# Altium project 100-1069.PRJPCB (part 2 of 2)

## Sheet PAGE115.SchDoc
size 246 x 182 mm
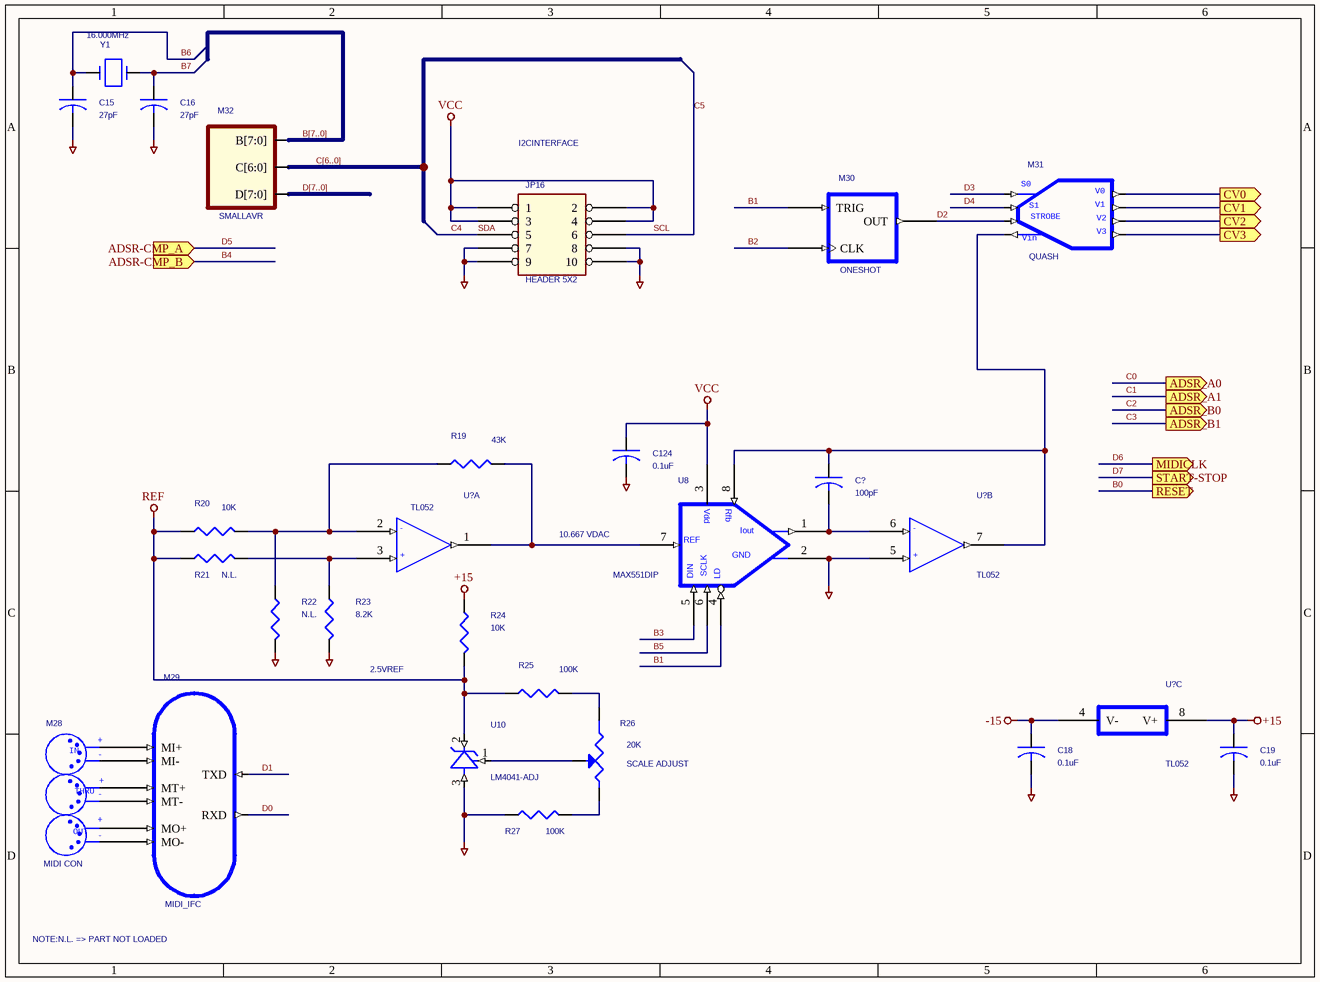
[diagram p13: PAGE115.SchDoc]

### Parts
(Parts that share a designator on the sheet are numbered #1, #2 ... from top to bottom, then left to right.)
C15  27pF  [RAD0.1]
C16  27pF  [RAD0.1]
C18  0.1uF  [AXIALCAP0.3]
C19  0.1uF  [AXIALCAP0.3]
C124  0.1uF  [AXIALCAP0.3]
C?#2  100pF  [RAD0.1]
JP16  HEADER 5X2  [IDC10-AMP]
M28  MIDI CON
M29  MIDI_IFC
M30  ONESHOT
M31  QUASH
M32  SMALLAVR
R19  43K  [AXIAL0.4]
R20  10K  [AXIAL0.4]
R21  N.L.  [AXIAL0.4]
R22  N.L.  [AXIAL0.4]
R23  8.2K  [AXIAL0.4]
R24  10K  [AXIAL0.4]
R25  100K  [AXIAL0.4]
R26  20K  [TRIMPOT-3006]
R27  100K  [AXIAL0.4]
U8  MAX551DIP  [DIP8]
U10  LM4041-ADJ  [TO92-LM336]
U?#1  TL052  [DIP8]  (part A of 3)
U?#2  TL052  [DIP8]  (part B of 3)
U?#3  TL052  [DIP8]  (part C of 3)
Y1  16.000MHz  [XTAL]

### Ports
ADSR-CMP_A (in), ADSR-CMP_B (in), ADSR_A0 (out), ADSR_A1 (out), ADSR_B0 (out), ADSR_B1 (out), CV0 (out), CV1 (out), CV2 (out), CV3 (out), MIDICLK (out), RESET (out), START-STOP (out)

### Nets
+15: C19.1 R24.1 U?#3.8(V+)
-15: C18.1 U?#3.4(V-)
AGND: C15.2 C16.2 C18.2 C19.2 C124.2 JP16.7 JP16.8 JP16.9 JP16.10 R22.2 R23.2 R27.1 U8.2(GND) U10.3(ANODE) U?#2.5(+)  [project net S2]
REF: R20.1 R21.1 R24.2 R25.1 U10.2(CATHODE)
VCC: C124.1 JP16.1 JP16.2 JP16.3 JP16.4 U8.3(VDD)
B1: M30.TRIG U8.4(LD)
B2: M30.CLK
B3: U8.5(DIN)
B5: U8.6(SCLK)
B6: C15.1 Y1.2
B7: C16.1 Y1.1
C4: JP16.5  [also labelled SDA]
C5: JP16.6  [also labelled SCL]
D0: M29.RXD
D1: M29.TXD
D2: M30.OUT M31.STROBE
D3: M31.S0
D4: M31.S1
LFO-F: M31.VO2 ; port CV2
NetC?#2_1: C?#2.1 M31.VIN U8.8(Rfb) U?#2.7(OUT)
NetC?#2_2: C?#2.2 U8.1(Iout) U?#2.6(-)
NetM1#1_IN: M31.VO1 ; port CV1
NetM10_IN: M31.VO0 ; port CV0
NetM28_MI+: M28.MI+ M29.MI+
NetM28_MI-: M28.MI- M29.MI-
NetM28_MO+: M28.MO+ M29.MO+
NetM28_MO-: M28.MO- M29.MO-
NetM28_MT+: M28.MT+ M29.MT+
NetM28_MT-: M28.MT- M29.MT-
NetM31_VO3: M31.VO3 ; port CV3
NetR19_1: R19.1 R20.2 R22.1 U?#1.2(-)
NetR19_2: R19.2 U8.7(VREF) U?#1.1(OUT)
NetR21_2: R21.2 R23.1 U?#1.3(+)
NetR25_2: R25.2 R26.B
NetR26_A: R26.A R27.2
NetR26_WIPER: R26.WIPER U10.1(ADJ)

Not connected (* = marked no-connect by the designer): M32 B[7:0] C[6:0] D[7:0]

### Buses and harness runs
bus B[7..0]
bus C[6..0]
bus D[7..0]

### Notes on the sheet
- I2CINTERFACE
- 10.667 VDAC
- 2.5VREF
- (near R26) SCALE ADJUST
- NOTE:N.L. => PART NOT LOADED
- (in symbol MAX551DIP) Vdd; REF
- (in symbol MIDI CON) +; IN; -; THRU; OUT
- (in symbol QUASH) V0; V1; V2; V3; Vin

### Library data of the parts
C15 C16 C18 C19 C124 C?#2 = CAP_Dup1
R19-R25 R27 = R_Dup1
R26 = POT
U?#1-U?#3 = GEN DUAL OPAMP-H: PACKAGE: MIDI2CV
Y1 = CRYSTAL
M28 = MIDI CON: TitleBlock_1_Page_Number: =M28_TitleBlock_1_Page_Number; TitleBlock_1_Title: =M28_TitleBlock_1_Title
M29 = MIDI_IFC: TitleBlock_4_Page_Number: =M29_TitleBlock_4_Page_Number
M31 = QUASH: C__13_PartReference: =M31_C__13_PartReference; M34_C__21_PartReference: =M31_M34_C__21_PartReference; M34_TitleBlock_1_Page_Number: =M31_M34_TitleBlock_1_Page_Number; M34_TitleBlock_1_Title: =M31_M34_TitleBlock_1_Title; C__14_PartReference: =M31_C__14_PartReference

## Sheet PAGE117.SchDoc
size 246 x 182 mm
Used 2 times, as channels VCO1, VCO2. Parts and nets are listed once, with the designators drawn on the sheet.
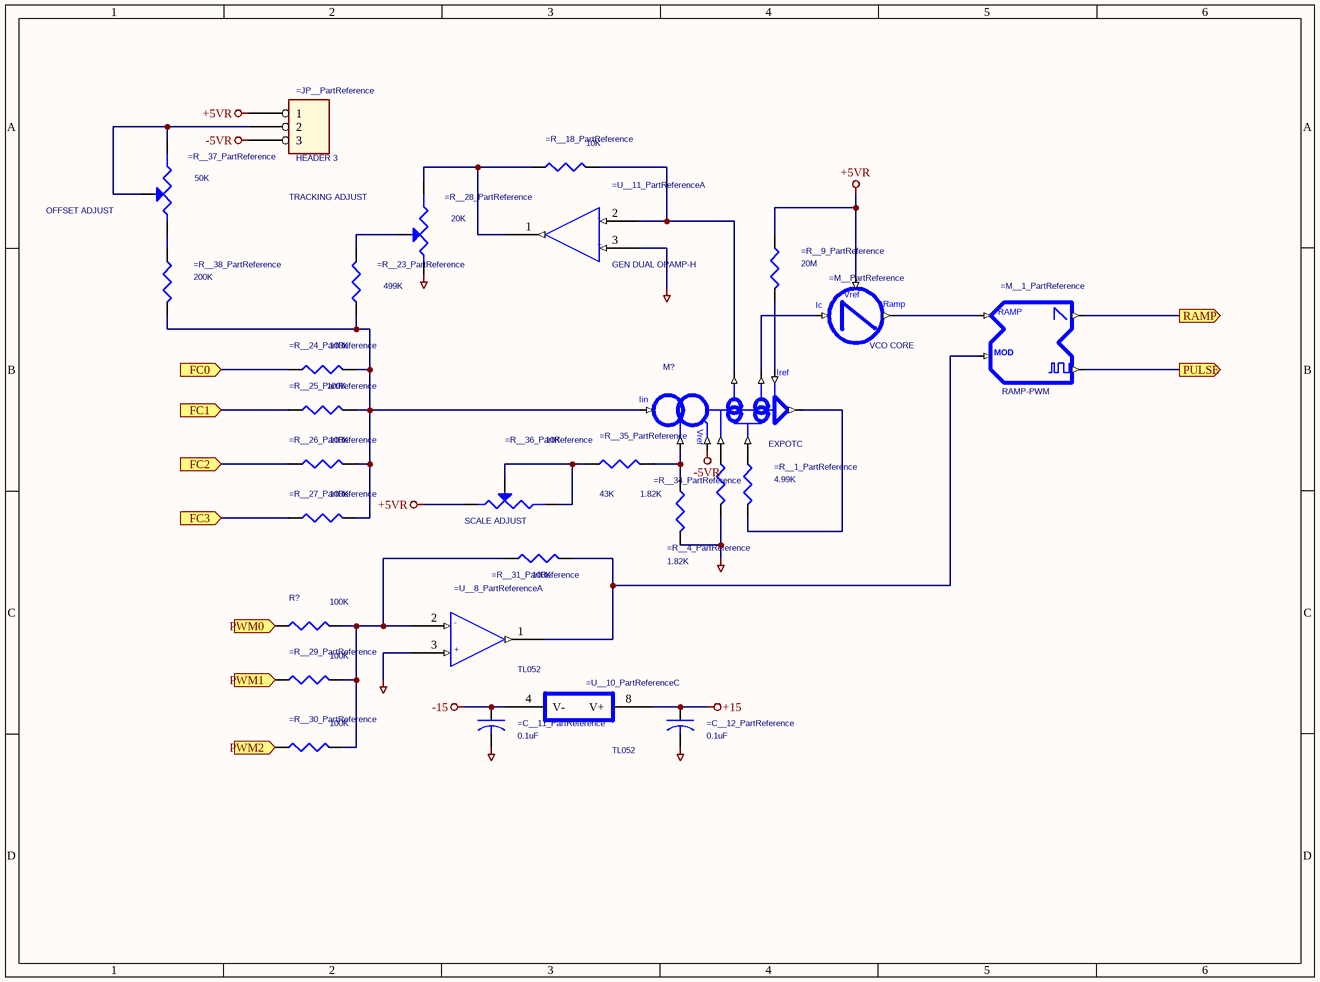
[diagram p14: PAGE117.SchDoc]

### Parts
=C__11_PartReference  0.1uF  [AXIALCAP0.3]
=C__12_PartReference  0.1uF  [AXIALCAP0.3]
=JP__PartReference  HEADER 3  [JP3]
=M__1_PartReference  RAMP-PWM
=M__PartReference  VCO CORE
=R__1_PartReference  4.99K  [AXIAL0.4]
=R__4_PartReference  1.82K  [AXIAL0.4]
=R__9_PartReference  20M  [AXIAL0.4]
=R__18_PartReference  10K  [AXIAL0.4]
=R__23_PartReference  499K  [AXIAL0.4]
=R__24_PartReference  100K  [AXIAL0.4]
=R__25_PartReference  100K  [AXIAL0.4]
=R__26_PartReference  100K  [AXIAL0.4]
=R__27_PartReference  100K  [AXIAL0.4]
=R__28_PartReference  20K  [TRIMPOT-3006]
=R__29_PartReference  100K  [AXIAL0.4]
=R__30_PartReference  100K  [AXIAL0.4]
=R__31_PartReference  100K  [AXIAL0.4]
=R__34_PartReference  1.82K  [AXIAL0.4]
=R__35_PartReference  43K  [AXIAL0.4]
=R__36_PartReference  10K  [TRIMPOT-3006]
=R__37_PartReference  50K  [TRIMPOT-3006]
=R__38_PartReference  200K  [AXIAL0.4]
=U__8_PartReference  TL052  [DIP8]  (part A of 3)
=U__10_PartReference  TL052  [DIP8]  (part C of 3)
=U__11_PartReference  GEN DUAL OPAMP-H  [DIP8]  (part A of 3)
M?  EXPOTC
R?  100K  [AXIAL0.4]

### Ports
FC0 (in), FC1 (in), FC2 (in), FC3 (in), PULSE (out), PWM0 (in), PWM1 (in), PWM2 (in), RAMP (out)

### Nets
+5VR: =JP__PartReference.1 =M__PartReference.VREF5P =R__9_PartReference.1 =R__36_PartReference.A
+15: =C__12_PartReference.1 =U__10_PartReference.8(V+)
-5VR: =JP__PartReference.3 M?.-VREF
-15: =C__11_PartReference.1 =U__10_PartReference.4(V-)
AGND: =C__11_PartReference.2 =C__12_PartReference.2 =R__4_PartReference.2 =R__28_PartReference.A =R__34_PartReference.2 =U__8_PartReference.3(+) =U__11_PartReference.3(+)
FC0: =R__24_PartReference.1 ; port FC0
FC1: =R__25_PartReference.1 ; port FC1
FC2: =R__26_PartReference.1 ; port FC2
FC3: =R__27_PartReference.1 ; port FC3
PULSE: =M__1_PartReference.PWMOUT ; port PULSE
PWM0: R?.1 ; port PWM0
PWM1: =R__29_PartReference.1 ; port PWM1
PWM2: =R__30_PartReference.1 ; port PWM2
RAMP: =M__1_PartReference.RAMPOUT ; port RAMP
Net=JP__PartReference_2: =JP__PartReference.2 =R__37_PartReference.B =R__37_PartReference.WIPER
Net=M__1_PartReference_PWMIN: =M__1_PartReference.PWMIN =R__31_PartReference.2 =U__8_PartReference.1(OUT)
Net=M__1_PartReference_RAMPIN: =M__1_PartReference.RAMPIN =M__PartReference.RAMP
Net=M__PartReference_Ic: =M__PartReference.Ic M?.Io2
Net=R__1_PartReference_1: =R__1_PartReference.1 M?.E
Net=R__1_PartReference_2: =R__1_PartReference.2 M?.O
Net=R__4_PartReference_1: =R__4_PartReference.1 M?.R
Net=R__9_PartReference_2: =R__9_PartReference.2 M?.Iref
Net=R__18_PartReference_1: =R__18_PartReference.1 =R__28_PartReference.B =U__11_PartReference.1(OUT)
Net=R__18_PartReference_2: =R__18_PartReference.2 =U__11_PartReference.2(-) M?.Io1
Net=R__23_PartReference_1: =R__23_PartReference.1 =R__24_PartReference.2 =R__25_PartReference.2 =R__26_PartReference.2 =R__27_PartReference.2 =R__38_PartReference.2 M?.Iin
Net=R__23_PartReference_2: =R__23_PartReference.2 =R__28_PartReference.WIPER
Net=R__29_PartReference_2: =R__29_PartReference.2 =R__30_PartReference.2 =R__31_PartReference.1 =U__8_PartReference.2(-) R?.2
Net=R__34_PartReference_1: =R__34_PartReference.1 =R__35_PartReference.2 M?.GAIN
Net=R__35_PartReference_1: =R__35_PartReference.1 =R__36_PartReference.B =R__36_PartReference.WIPER
Net=R__37_PartReference_A: =R__37_PartReference.A =R__38_PartReference.1

### Channels
VCO1: designators end in _VCO1; ports FC0=Net=R__24_PartReference_VCO1_1 FC1=VP1 FC2=Net=R__26_PartReference_VCO1_1 FC3=Net=R__27_PartReference_VCO1_1 PULSE=Net=M__1_PartReference_VCO1_PWMOUT PWM0=PW1 PWM1=Net=R__29_PartReference_VCO1_1 PWM2=Net=R__30_PartReference_VCO1_1 RAMP=Net=M__1_PartReference_VCO1_RAMPOUT
VCO2: designators end in _VCO2; ports FC0=Net=R__24_PartReference_VCO1_1 FC1=VP2 FC2=Net=R__26_PartReference_VCO1_1 FC3=Net=R__27_PartReference_VCO1_1 PULSE=Net=M__1_PartReference_VCO2_PWMOUT PWM0=PW2 PWM1=Net=R__29_PartReference_VCO1_1 PWM2=Net=R__30_PartReference_VCO1_1 RAMP=Net=M__1_PartReference_VCO2_RAMPOUT

### Notes on the sheet
- OFFSET ADJUST
- TRACKING ADJUST
- (near =R__36_PartReference) SCALE ADJUST
- (in symbol EXPOTC) Vref
- (in symbol RAMP-PWM) RAMP; MOD
- (in symbol VCO CORE_0) Vref; Ramp

### Library data of the parts
=C__11_PartReference =C__12_PartReference = CAP_Dup1
=M__PartReference = VCO CORE_0: U__18_PartReference: =M__U__18_PartReference; C__23_PartReference: =M__C__23_PartReference; Q__12_PartReference: =M__Q__12_PartReference; U__19_PartReference: =M__U__19_PartReference; C__22_PartReference: =M__C__22_PartReference; C__24_PartReference: =M__C__24_PartReference; C__25_PartReference: =M__C__25_PartReference; C__26_PartReference: =M__C__26_PartReference; R__49_PartReference: =M__R__49_PartReference; C__27_PartReference: =M__C__27_PartReference; R__50_PartReference: =M__R__50_PartReference; R__47_PartReference: =M__R__47_PartReference; R__48_PartReference: =M__R__48_PartReference; TitleBlock_6_Page_Number: =M__TitleBlock_6_Page_Number
=R__1_PartReference =R__4_PartReference =R__9_PartReference =R__18_PartReference =R__23_PartReference =R__24_PartReference =R__25_PartReference =R__26_PartReference =R__27_PartReference =R__29_PartReference =R__30_PartReference =R__31_PartReference =R__34_PartReference =R__35_PartReference =R__38_PartReference R? = R_Dup1
=R__28_PartReference =R__36_PartReference =R__37_PartReference = POT
=U__8_PartReference =U__10_PartReference = GEN DUAL OPAMP-H
  =U__8_PartReference: PACKAGE: =U__8_PACKAGE
  =U__10_PartReference: PACKAGE: =U__10_PACKAGE
=M__1_PartReference = RAMP-PWM: M26_PartReference: =M__1_M26_PartReference; M26_PACKAGE: =M__1_M26_PACKAGE; D__PartReference: =M__1_D__PartReference; D__1_PartReference: =M__1_D__1_PartReference; M27_PartReference: =M__1_M27_PartReference; M27_PACKAGE: =M__1_M27_PACKAGE; C__PartReference: =M__1_C__PartReference; U__PartReference: =M__1_U__PartReference; U__PACKAGE: =M__1_U__PACKAGE; C__1_PartReference: =M__1_C__1_PartReference; R__7_PartReference: =M__1_R__7_PartReference; R__10_PartReference: =M__1_R__10_PartReference; R__11_PartReference: =M__1_R__11_PartReference; R__13_PartReference: =M__1_R__13_PartReference; R__20_PartReference: =M__1_R__20_PartReference; R__21_PartReference: =M__1_R__21_PartReference; R__22_PartReference: =M__1_R__22_PartReference; TitleBlock_Page_Number: =M__1_TitleBlock_Page_Number; TitleBlock_Title: =M__1_TitleBlock_Title
=U__11_PartReference = GEN DUAL OPAMP-H: PACKAGE: =U__11_PACKAGE

## Sheet PAGE110.SchDoc
size 246 x 182 mm
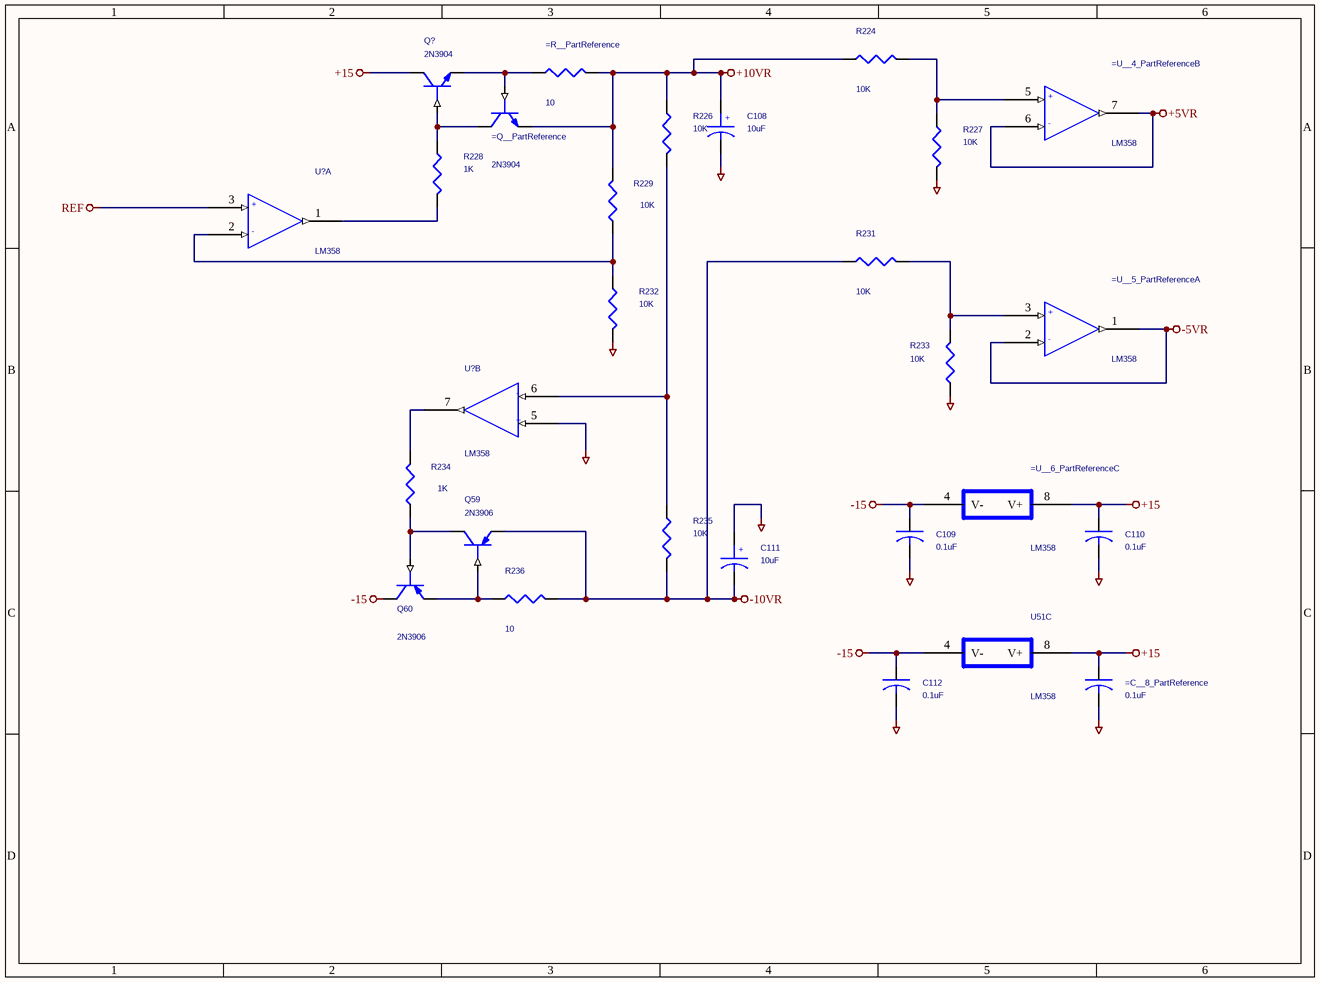
[diagram p15: PAGE110.SchDoc]

### Parts
(Parts that share a designator on the sheet are numbered #1, #2 ... from top to bottom, then left to right.)
=C__8_PartReference  0.1uF  [AXIALCAP0.3]
=Q__PartReference  2N3904  [TO92]
=R__PartReference  10  [AXIAL0.4]
=U__4_PartReference  LM358  [DIP8]  (part B of 3)
=U__5_PartReference  LM358  [DIP8]  (part A of 3)
=U__6_PartReference  LM358  [DIP8]  (part C of 3)
C108  10uF  [RB5/2]
C109  0.1uF  [AXIALCAP0.3]
C110  0.1uF  [AXIALCAP0.3]
C111  10uF  [RB5/2]
C112  0.1uF  [AXIALCAP0.3]
Q59  2N3906  [TO92]
Q60  2N3906  [TO92]
Q?#1  2N3904  [TO92]
R224  10K  [AXIAL0.4]
R226  10K  [AXIAL0.4]
R227  10K  [AXIAL0.4]
R228  1K  [AXIAL0.4]
R229  10K  [AXIAL0.4]
R231  10K  [AXIAL0.4]
R232  10K  [AXIAL0.4]
R233  10K  [AXIAL0.4]
R234  1K  [AXIAL0.4]
R235  10K  [AXIAL0.4]
R236  10  [AXIAL0.4]
U51  LM358  [DIP8]  (part C of 3)
U?#4  LM358  [DIP8]  (part A of 3)
U?#5  LM358  [DIP8]  (part B of 3)

### Nets
+5VR: =U__4_PartReference.6(-) =U__4_PartReference.7(OUT)
+10VR: =Q__PartReference.EMITTER =R__PartReference.2 C108.1 R224.1 R226.1 R229.2
+15: =C__8_PartReference.1 =U__6_PartReference.8(V+) C110.1 Q?#1.COLLECTOR U51.8(V+)
-5VR: =U__5_PartReference.1(OUT) =U__5_PartReference.2(-)
-10VR: C111.2 Q59.EMITTER R231.1 R235.2 R236.2
-15: =U__6_PartReference.4(V-) C109.1 C112.1 Q60.COLLECTOR U51.4(V-)
AGND: =C__8_PartReference.2 C108.2 C109.2 C110.2 C111.1 C112.2 R227.2 R232.2 R233.1 U?#5.5(+)  [project net S2]
REF: U?#4.3(+)
Net=Q__PartReference_BASE: =Q__PartReference.BASE =R__PartReference.1 Q?#1.EMITTER
Net=Q__PartReference_COLLECTOR: =Q__PartReference.COLLECTOR Q?#1.BASE R228.1
Net=U__4_PartReference_5: =U__4_PartReference.5(+) R224.2 R227.1
Net=U__5_PartReference_3: =U__5_PartReference.3(+) R231.2 R233.2
NetQ59_BASE: Q59.BASE Q60.EMITTER R236.1
NetQ59_COLLECTOR: Q59.COLLECTOR Q60.BASE R234.1
NetR226_2: R226.2 R235.1 U?#5.6(-)
NetR228_2: R228.2 U?#4.1(OUT)
NetR229_1: R229.1 R232.1 U?#4.2(-)
NetR234_2: R234.2 U?#5.7(OUT)

### Notes on the sheet
- (in symbol CAPACITOR POL) +

### Library data of the parts
=C__8_PartReference C109 C110 C112 = CAP_Dup1
=Q__PartReference Q?#1 = NPN
=R__PartReference R224 R226-R229 R231-R236 = R_Dup1
  =R__PartReference: M26_PartReference: =R__M26_PartReference; M26_PACKAGE: =R__M26_PACKAGE; U__7_PartReference: =R__U__7_PartReference; U__7_PACKAGE: =R__U__7_PACKAGE; M27_PartReference: =R__M27_PartReference; M27_PACKAGE: =R__M27_PACKAGE; U__2_PartReference: =R__U__2_PartReference; U__2_PACKAGE: =R__U__2_PACKAGE; U__PartReference: =R__U__PartReference; U__PACKAGE: =R__U__PACKAGE; C__4_PartReference: =R__C__4_PartReference; U__3_PartReference: =R__U__3_PartReference; U__3_PACKAGE: =R__U__3_PACKAGE; Q__PartReference: =R__Q__PartReference; C__6_PartReference: =R__C__6_PartReference; C__7_PartReference: =R__C__7_PartReference; Q__1_PartReference: =R__Q__1_PartReference; C__5_PartReference: =R__C__5_PartReference; Q__2_PartReference: =R__Q__2_PartReference; Q__3_PartReference: =R__Q__3_PartReference; R__14_PartReference: =R__R__14_PartReference; R__15_PartReference: =R__R__15_PartReference; TitleBlock_Page_Number: =R__TitleBlock_Page_Number; TitleBlock_Title: =R__TitleBlock_Title
=U__4_PartReference =U__5_PartReference =U__6_PartReference U51 U?#4 U?#5 = GEN DUAL OPAMP-H
  =U__4_PartReference =U__6_PartReference U?#4: PACKAGE: REF_1
  =U__5_PartReference U51 U?#5: PACKAGE: REF_2
C108 C111 = CAPACITOR POL
Q59 Q60 = PNP

## Sheet LFO.SchDoc
size 246 x 182 mm
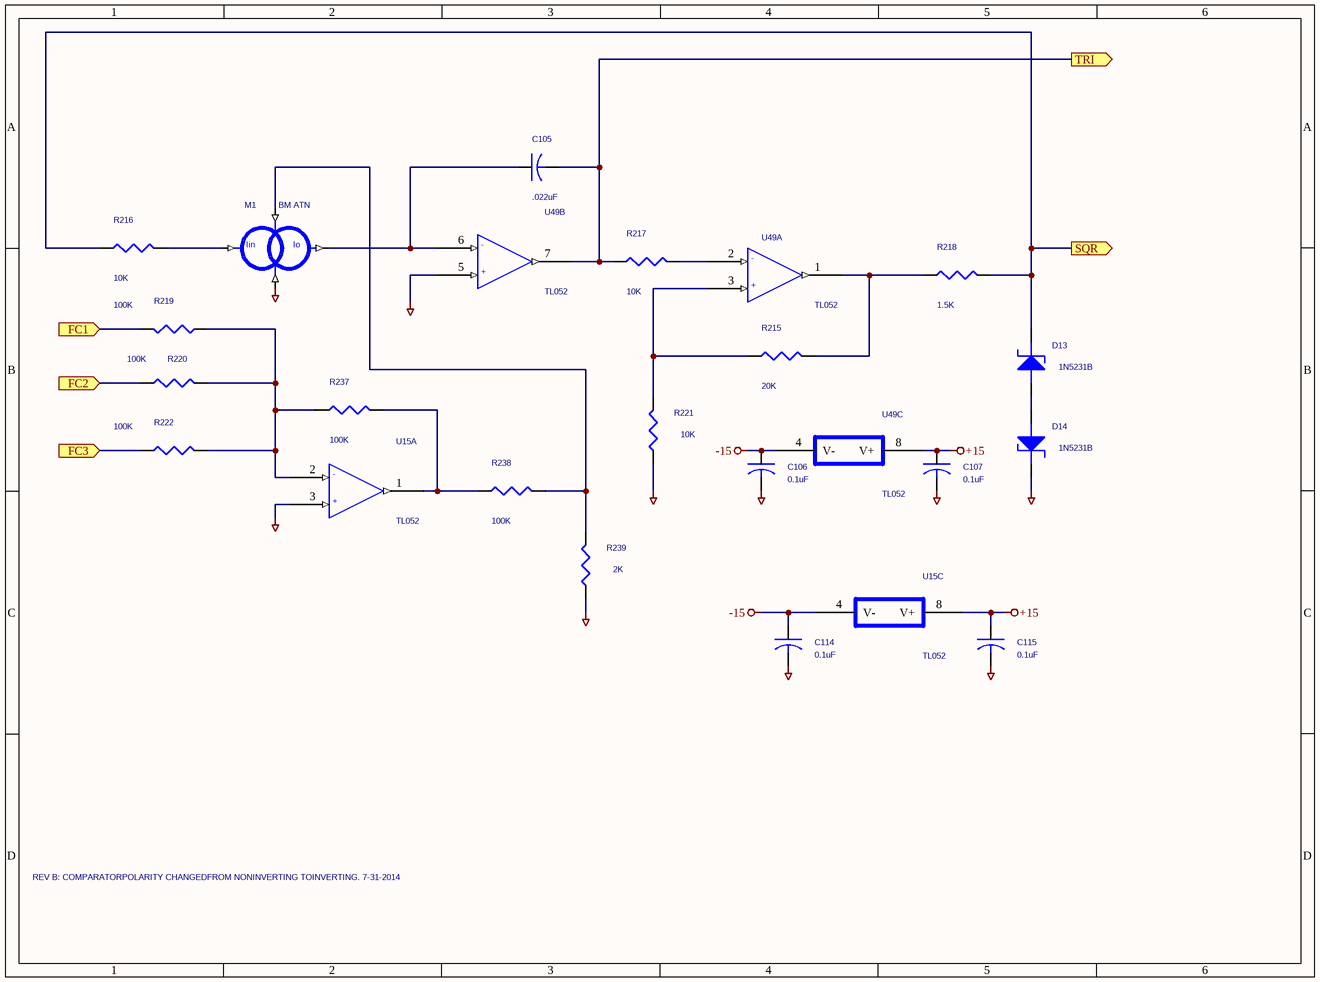
[diagram p16: LFO.SchDoc]

### Parts
(Parts that share a designator on the sheet are numbered #1, #2 ... from top to bottom, then left to right.)
C105  .022uF  [CAP-MY0.2X.1]
C106  0.1uF  [AXIALCAP0.3]
C107  0.1uF  [AXIALCAP0.3]
C114  0.1uF  [AXIALCAP0.3]
C115  0.1uF  [AXIALCAP0.3]
D13  1N5231B  [DIODE0.4]
D14  1N5231B  [DIODE0.4]
M1#2  BM ATN
R215  20K  [AXIAL0.4]
R216  10K  [AXIAL0.4]
R217  10K  [AXIAL0.4]
R218  1.5K  [AXIAL0.4]
R219  100K  [AXIAL0.4]
R220  100K  [AXIAL0.4]
R221  10K  [AXIAL0.4]
R222  100K  [AXIAL0.4]
R237  100K  [AXIAL0.4]
R238  100K  [AXIAL0.4]
R239  2K  [AXIAL0.4]
U15  TL052  [DIP8]  (parts A,C of 3)
U49  TL052  [DIP8]  (parts A,B,C of 3)

### Ports
FC1 (in), FC2 (in), FC3 (in), SQR (out), TRI (out)

### Nets
+15: C107.1 C115.1 U15.8(V+) U49.8(V+)
-15: C106.1 C114.1 U15.4(V-) U49.4(V-)
AGND: C106.2 C107.2 C114.2 C115.2 D14.CATHODE M1#2.CVP R221.1 R239.1 U15.3(+) U49.5(+)  [project net S2]
NetC105_1: C105.1 M1#2.Io U49.6(-)
NetC105_2: C105.2 R217.1 U49.7(OUT) ; port TRI
NetD13_ANODE: D13.ANODE D14.ANODE
NetD13_CATHODE: D13.CATHODE R216.1 R218.2 ; port SQR
NetM1#2_CVN: M1#2.CVN R238.2 R239.2
NetM1#2_Iin: M1#2.Iin R216.2
NetR215_1: R215.1 R221.2 U49.3(+)
NetR215_2: R215.2 R218.1 U49.1(OUT)
NetR217_2: R217.2 U49.2(-)
NetR219_1: R219.1 R220.2 R222.2 R237.1 U15.2(-)
NetR219_2: R219.2 ; port FC1
NetR220_1: R220.1 ; port FC2
NetR222_1: R222.1 ; port FC3
NetR237_2: R237.2 R238.1 U15.1(OUT)

### Notes on the sheet
- REV B: COMPARATORPOLARITY CHANGEDFROM NONINVERTING TOINVERTING. 7-31-2014

### Library data of the parts
C105-C107 C114 C115 = CAP_Dup1
D13 D14 = DIODE ZENER_Dup1: DIGIKEY PN: 1N5231BFSCT-ND
R215-R222 R237-R239 = R_Dup1
  R215: MOUSER PN: 271-20K-RC
  R216 R217 R221: MOUSER PN: 271-10K-RC
  R218: MOUSER PN: 271-1.5K-RC
  R219 R220 R222: MOUSER PN: 271-100K-RC
  R239: MOUSER PN: 271-2K-RC
U15 = GEN DUAL OPAMP-H: PACKAGE: GLIDE2
U49 = TL052N: PACKAGE: LFO_1; DIGIKEY PN: 296-7163-5-ND
M1#2 = BM ATN: TitleBlock_2_Page_Number: =M1_1_TitleBlock_2_Page_Number; TitleBlock_2_Title: =M1_1_TitleBlock_2_Title

## Sheet PAGE114.SchDoc
size 246 x 182 mm
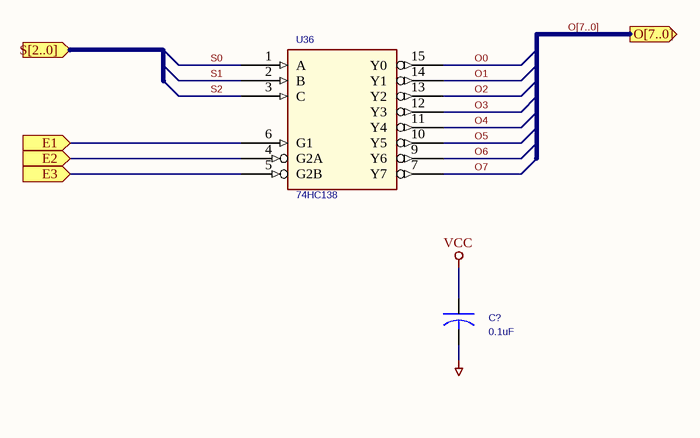
[diagram p17: PAGE114.SchDoc]

### Parts
(Parts that share a designator on the sheet are numbered #1, #2 ... from top to bottom, then left to right.)
C?#3  0.1uF  [AXIALCAP0.3]
U36  74HC138  [DIP16]

### Ports
E1 (in), E2 (in), E3 (in), O[7..0] (out), S[2..0] (in)

### Nets
AGND: C?#3.2 U36.8(GND)  [also labelled GND]  [project net S2]
VCC: C?#3.1 U36.16(VCC)
O0: U36.15(Y0)
O1: U36.14(Y1)
O2: U36.13(Y2)
O3: U36.12(Y3)
O4: U36.11(Y4)
O5: U36.10(Y5)
O6: U36.9(Y6)
O7: U36.7(Y7)
S0: U36.1(A)
S1: U36.2(B)
S2: U36.3(C)
NetU36_4: U36.4(G2A) ; port E2
NetU36_5: U36.5(G2B) ; port E3
NetU36_6: U36.6(G1) ; port E1

### Buses and harness runs
bus O[7..0] = port O[7..0]

### Library data of the parts
C?#3 = CAP_Dup1: PART NO: 80-C410C104M5U

## Sheet GLIDE.SchDoc
size 246 x 182 mm
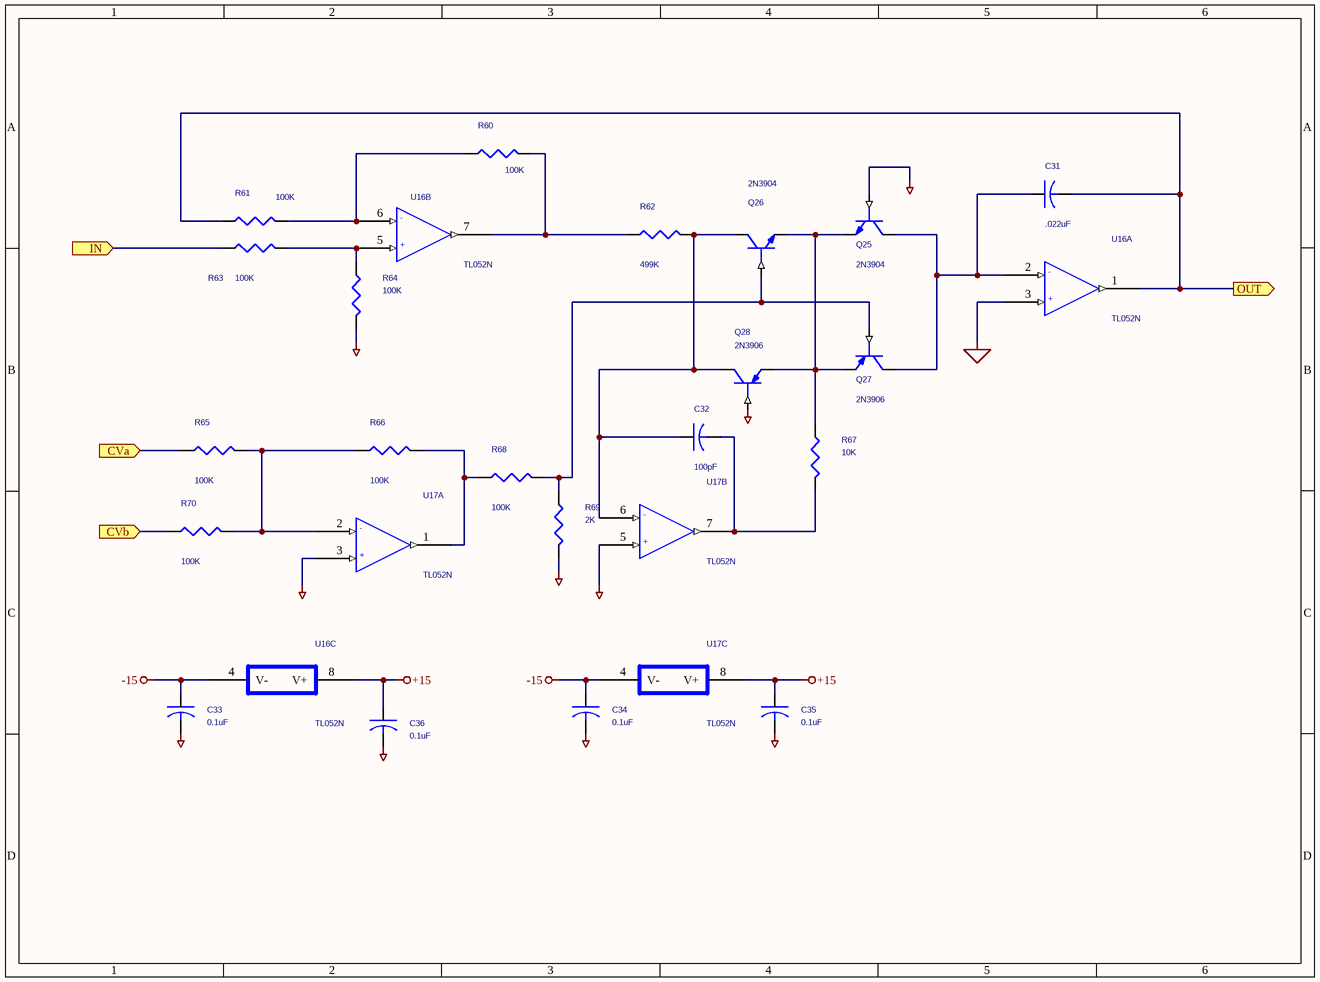
[diagram p18: GLIDE.SchDoc]

### Parts
C31  .022uF  [CAP-MY0.2X.1]
C32  100pF  [RAD0.1]
C33  0.1uF  [AXIALCAP0.3]
C34  0.1uF  [AXIALCAP0.3]
C35  0.1uF  [AXIALCAP0.3]
C36  0.1uF  [AXIALCAP0.3]
Q25  2N3904  [TO92]
Q26  2N3904  [TO92]
Q27  2N3906  [TO92]
Q28  2N3906  [TO92]
R60  100K  [AXIAL0.4]
R61  100K  [AXIAL0.4]
R62  499K  [AXIAL0.4]
R63  100K  [AXIAL0.4]
R64  100K  [AXIAL0.4]
R65  100K  [AXIAL0.4]
R66  100K  [AXIAL0.4]
R67  10K  [AXIAL0.4]
R68  100K  [AXIAL0.4]
R69  2K  [AXIAL0.4]
R70  100K  [AXIAL0.4]
U16  TL052N  [DIP8]  (parts A,B,C of 3)
U17  TL052N  [DIP8]  (parts A,B,C of 3)

### Ports
CVa (in), CVb (in), IN (in), OUT (out)

### Nets
+15: C35.1 C36.1 U16.8(V+) U17.8(V+)
-15: C33.1 C34.1 U16.4(V-) U17.4(V-)
AGND: C33.2 C34.2 C35.2 C36.2 Q25.BASE Q28.BASE R64.2 R69.2 U17.3(+) U17.5(+)  [project net S2]
GND_SIGNAL: U16.3(+)
NetC31_1: C31.1 Q25.COLLECTOR Q27.COLLECTOR U16.2(-)
NetC31_2: C31.2 R61.1 U16.1(OUT) ; port OUT
NetC32_1: C32.1 Q26.COLLECTOR Q28.COLLECTOR R62.2 U17.6(-)
NetC32_2: C32.2 R67.2 U17.7(OUT)
NetQ25_EMITTER: Q25.EMITTER Q26.EMITTER Q27.EMITTER Q28.EMITTER R67.1
NetQ26_BASE: Q26.BASE Q27.BASE R68.2 R69.1
NetR60_1: R60.1 R61.2 U16.6(-)
NetR60_2: R60.2 R62.1 U16.7(OUT)
NetR63_1: R63.1 ; port IN
NetR63_2: R63.2 R64.1 U16.5(+)
NetR65_1: R65.1 ; port CVa
NetR65_2: R65.2 R66.1 R70.2 U17.2(-)
NetR66_2: R66.2 R68.1 U17.1(OUT)
NetR70_1: R70.1 ; port CVb

### Library data of the parts
C31-C36 = CAP_Dup1
  C31: DIGIKEY PN: P4717-ND
  C32: MOUSER PN: 140-50P2-101K-RC
Q25 Q26 = NPN: DIGIKEY PN: 2N3904FS-ND
Q27 Q28 = PNP: DIGIKEY PN: 2N3906FS-ND
R60-R70 = R_Dup1
  R60 R61 R63-R66 R68 R70: MOUSER PN: 271-100K-RC
  R62: MOUSER PN: 271-499K-RC
  R67: MOUSER PN: 271-10K-RC
  R69: MOUSER PN: 271-2K-RC
U16 U17 = TL052N: DIGIKEY PN: 296-7163-5-ND
  U16: PACKAGE: GLIDE_1
  U17: PACKAGE: GLIDE_2

## Sheet PAGE116.SchDoc
size 246 x 182 mm
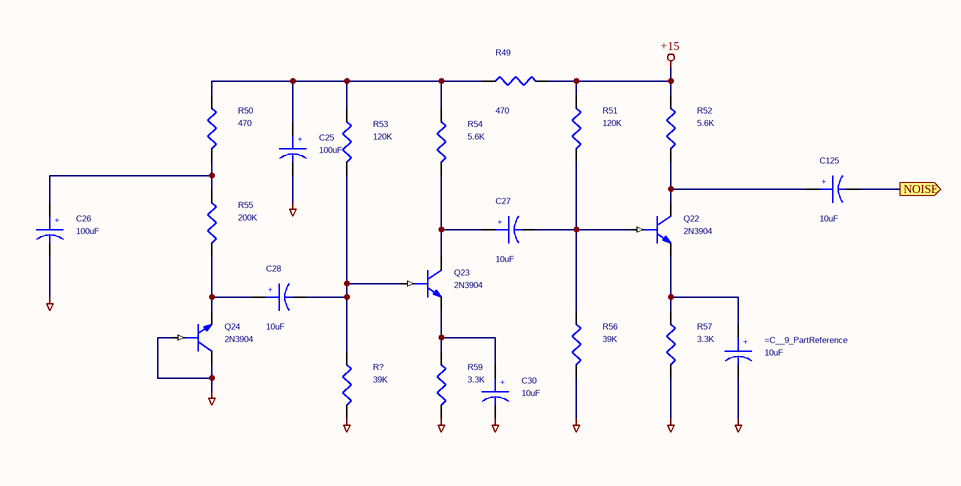
[diagram p19: PAGE116.SchDoc]

### Parts
=C__9_PartReference  10uF  [RB5/2]
C25  100uF  [RB0.3/0.1]
C26  100uF  [RB0.3/0.1]
C27  10uF  [RB5/2]
C28  10uF  [RB5/2]
C30  10uF  [RB5/2]
C125  10uF  [RB5/2]
Q22  2N3904  [TO92]
Q23  2N3904  [TO92]
Q24  2N3904  [TO92]
R49  470  [AXIAL0.4]
R50  470  [AXIAL0.4]
R51  120K  [AXIAL0.4]
R52  5.6K  [AXIAL0.4]
R53  120K  [AXIAL0.4]
R54  5.6K  [AXIAL0.4]
R55  200K  [AXIAL0.4]
R56  39K  [AXIAL0.4]
R57  3.3K  [AXIAL0.4]
R59  3.3K  [AXIAL0.4]
R?  39K  [AXIAL0.4]

### Ports
NOISE (out)

### Nets
+15: R49.2 R51.1 R52.1
AGND: =C__9_PartReference.2 C25.2 C26.2 C30.2 Q24.BASE Q24.COLLECTOR R56.2 R57.2 R59.2 R?.2  [project net S2]
Net=C__9_PartReference_1: =C__9_PartReference.1 Q22.EMITTER R57.1
NetC25_1: C25.1 R49.1 R50.1 R53.1 R54.1
NetC26_1: C26.1 R50.2 R55.1
NetC27_1: C27.1 Q23.COLLECTOR R54.2
NetC27_2: C27.2 Q22.BASE R51.2 R56.1
NetC28_1: C28.1 Q24.EMITTER R55.2
NetC28_2: C28.2 Q23.BASE R53.2 R?.1
NetC30_1: C30.1 Q23.EMITTER R59.1
NetC125_1: C125.1 Q22.COLLECTOR R52.2
NetC125_2: C125.2 ; port NOISE

### Notes on the sheet
- (in symbol CAPACITOR POL) +

### Library data of the parts
=C__9_PartReference C25-C28 C30 C125 = CAPACITOR POL
  =C__9_PartReference: MOUSER PN: 667-EEA-GA1E100; PCB_Footprint: =C__9_PCB_Footprint
  C25 C26: MOUSER PN: 667-EEU-FR1E101
  C27 C28 C30 C125: MOUSER PN: 667-EEA-GA1E100
Q22-Q24 = NPN: DIGIKEY PN: 2N3904FS-ND
R49-R57 R59 R? = R_Dup1
  R49 R50: MOUSER PN: 271-470-RC
  R51 R53: MOUSER PN: 271-120K-RC
  R52 R54: MOUSER PN: 271-5.6K-RC
  R55: MOUSER PN: 271-200K-RC
  R56 R?: MOUSER PN: 271-39K-RC
  R57 R59: MOUSER PN: 271-3.3K-RC

## Sheet PAGE118.SchDoc
size 246 x 182 mm
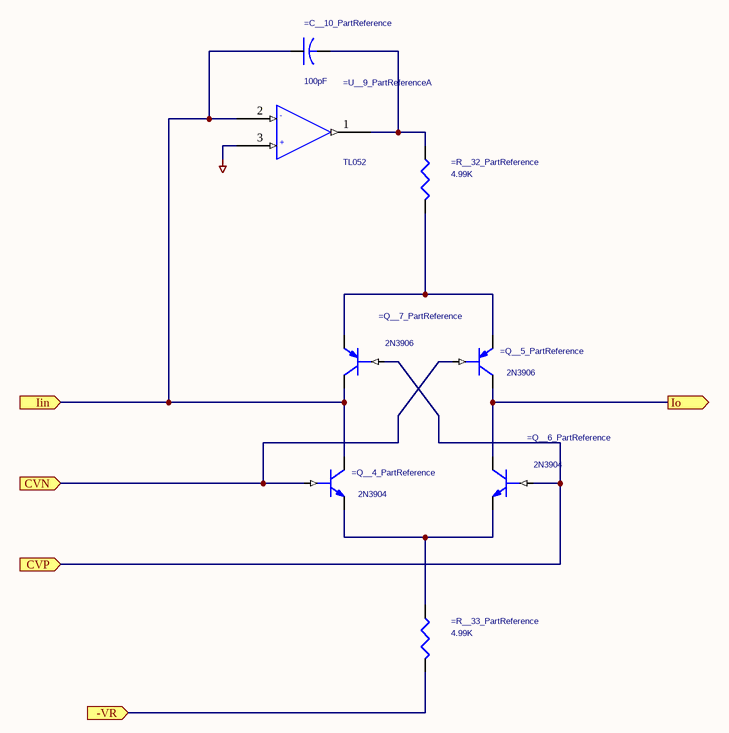
[diagram p20: PAGE118.SchDoc]

### Parts
=C__10_PartReference  100pF  [RAD0.1]
=Q__4_PartReference  2N3904  [TO92]
=Q__5_PartReference  2N3906  [TO92]
=Q__6_PartReference  2N3904  [TO92]
=Q__7_PartReference  2N3906  [TO92]
=R__32_PartReference  4.99K  [AXIAL0.4]
=R__33_PartReference  4.99K  [AXIAL0.4]
=U__9_PartReference  TL052  [DIP8]  (part A of 3)

### Ports
-VR (in), CVN (in), CVP (in), Iin (in), Io (out)

### Nets
AGND: =U__9_PartReference.3(+)  [project net S2]
Net=C__10_PartReference_1: =C__10_PartReference.1 =Q__4_PartReference.COLLECTOR =Q__7_PartReference.COLLECTOR =U__9_PartReference.2(-) ; port Iin
Net=C__10_PartReference_2: =C__10_PartReference.2 =R__32_PartReference.1 =U__9_PartReference.1(OUT)
Net=Q__4_PartReference_BASE: =Q__4_PartReference.BASE =Q__5_PartReference.BASE ; port CVN
Net=Q__4_PartReference_EMITTER: =Q__4_PartReference.EMITTER =Q__6_PartReference.EMITTER =R__33_PartReference.1
Net=Q__5_PartReference_COLLECTOR: =Q__5_PartReference.COLLECTOR =Q__6_PartReference.COLLECTOR ; port Io
Net=Q__5_PartReference_EMITTER: =Q__5_PartReference.EMITTER =Q__7_PartReference.EMITTER =R__32_PartReference.2
Net=Q__6_PartReference_BASE: =Q__6_PartReference.BASE =Q__7_PartReference.BASE ; port CVP
Net=R__33_PartReference_2: =R__33_PartReference.2 ; port -VR

### Library data of the parts
=C__10_PartReference = CAP_Dup1
=Q__4_PartReference =Q__6_PartReference = NPN
=Q__5_PartReference =Q__7_PartReference = PNP
=R__32_PartReference =R__33_PartReference = R_Dup1: MOUSER PN: 271-4.99K-RC
=U__9_PartReference = GEN DUAL OPAMP-H: PACKAGE: =U__9_PACKAGE

## Sheet PAGE119.SchDoc
size 246 x 182 mm
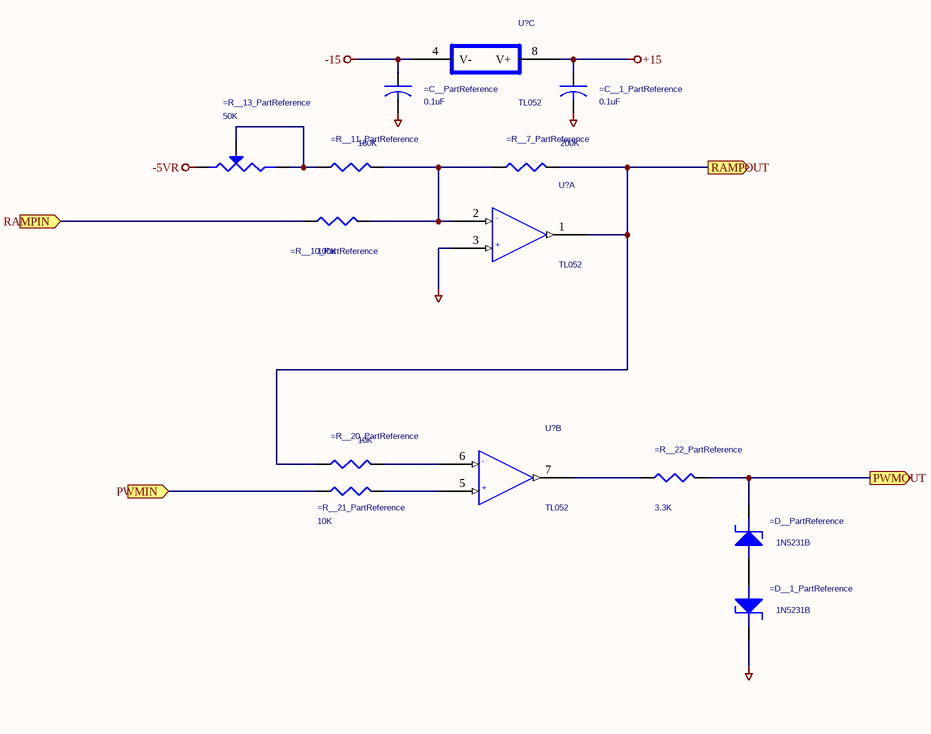
[diagram p21: PAGE119.SchDoc]

### Parts
(Parts that share a designator on the sheet are numbered #1, #2 ... from top to bottom, then left to right.)
=C__1_PartReference  0.1uF  [AXIALCAP0.3]
=C__PartReference  0.1uF  [AXIALCAP0.3]
=D__1_PartReference  1N5231B  [DIODE0.4]
=D__PartReference  1N5231B  [DIODE0.4]
=R__7_PartReference  200K  [AXIAL0.4]
=R__10_PartReference  100K  [AXIAL0.4]
=R__11_PartReference  180K  [AXIAL0.4]
=R__13_PartReference  50K  [TRIMPOT-3006]
=R__20_PartReference  10K  [AXIAL0.4]
=R__21_PartReference  10K  [AXIAL0.4]
=R__22_PartReference  3.3K  [AXIAL0.4]
U?#6  TL052  [DIP8]  (part C of 3)
U?#7  TL052  [DIP8]  (part A of 3)
U?#8  TL052  [DIP8]  (part B of 3)

### Ports
PWMIN (in), PWMOUT (out), RAMPIN (in), RAMPOUT (out)

### Nets
+15: =C__1_PartReference.1 U?#6.8(V+)
-5VR: =R__13_PartReference.A
-15: =C__PartReference.1 U?#6.4(V-)
AGND: =C__1_PartReference.2 =C__PartReference.2 =D__1_PartReference.CATHODE U?#7.3(+)  [project net S2]
Net=D__1_PartReference_ANODE: =D__1_PartReference.ANODE =D__PartReference.ANODE
Net=D__PartReference_CATHODE: =D__PartReference.CATHODE =R__22_PartReference.2 ; port PWMOUT
Net=R__7_PartReference_1: =R__7_PartReference.1 =R__10_PartReference.2 =R__11_PartReference.2 U?#7.2(-)
Net=R__7_PartReference_2: =R__7_PartReference.2 =R__20_PartReference.1 U?#7.1(OUT) ; port RAMPOUT
Net=R__10_PartReference_1: =R__10_PartReference.1 ; port RAMPIN
Net=R__11_PartReference_1: =R__11_PartReference.1 =R__13_PartReference.B =R__13_PartReference.WIPER
Net=R__20_PartReference_2: =R__20_PartReference.2 U?#8.6(-)
Net=R__21_PartReference_1: =R__21_PartReference.1 ; port PWMIN
Net=R__21_PartReference_2: =R__21_PartReference.2 U?#8.5(+)
Net=R__22_PartReference_1: =R__22_PartReference.1 U?#8.7(OUT)

### Library data of the parts
=C__1_PartReference =C__PartReference = CAP_Dup1
=D__1_PartReference =D__PartReference = DIODE ZENER
=R__7_PartReference =R__10_PartReference =R__11_PartReference =R__20_PartReference =R__21_PartReference =R__22_PartReference = R_Dup1
=R__13_PartReference = POT
U?#6-U?#8 = GEN DUAL OPAMP-H: PACKAGE: RAMP_PWM

## Sheet PAGE120.SchDoc
size 246 x 182 mm
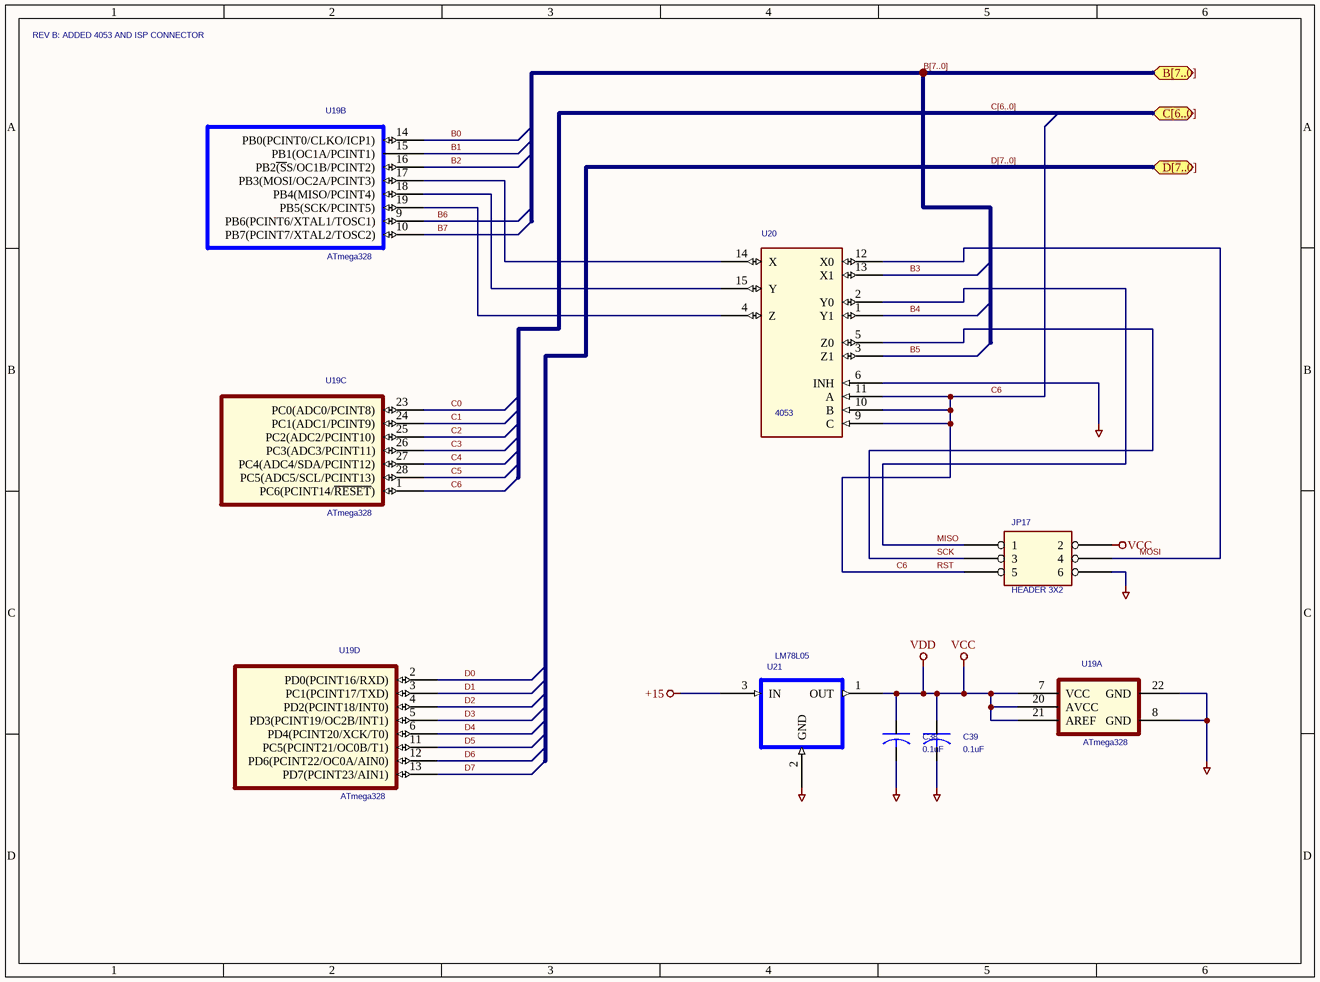
[diagram p22: PAGE120.SchDoc]

### Parts
C38  0.1uF  [AXIALCAP0.3]
C39  0.1uF  [AXIALCAP0.3]
JP17  HEADER 3X2  [JMPR6]
U19  ATmega328  [DIP28.3]  (parts A,B,C,D of 4)
U20  4053  [DIP16]
U21  LM78L05  [TO92-LM336]

### Ports
B[7..0] (bidir), C[6..0] (bidir), D[7..0] (bidir)

### Nets
+15: U21.3(IN)
AGND: C38.2 C39.2 JP17.6 U19.8(GND) U19.22(GND) U20.6(INH) U20.7(VEE) U20.8(VSS) U21.2(GND)  [also labelled VEE, VSS]  [project net S2]
VCC: C38.1 C39.1 JP17.2 U19.7(VCC) U19.20(AVCC) U19.21(AREF) U20.16(VDD) U21.1(OUT)  [also labelled VDD]
B0: U19.14(PB0(PCINT0/CLKO/ICP1))
B1: U19.15(PB1(OC1A/PCINT1))
B2: U19.16(PB2~{(S}S/OC1B/PCINT2))
B3: U20.13(X1)
B4: U20.1(Y1)
B5: U20.3(Z1)
B6: U19.9(PB6(PCINT6/XTAL1/TOSC1))
B7: U19.10(PB7(PCINT7/XTAL2/TOSC2))
C0: U19.23(PC0(ADC0/PCINT8))
C1: U19.24(PC1(ADC1/PCINT9))
C2: U19.25(PC2(ADC2/PCINT10))
C3: U19.26(PC3(ADC3/PCINT11))
C4: U19.27(PC4(ADC4/SDA/PCINT12))
C5: U19.28(PC5(ADC5/SCL/PCINT13))
C6: JP17.5 U19.1(PC6(PCINT14/~{RESET})) U20.9(C) U20.10(B) U20.11(A)  [also labelled RST]
D0: U19.2(PD0(PCINT16/RXD))
D1: U19.3(PC1(PCINT17/TXD))
D2: U19.4(PD2(PCINT18/INT0))
D3: U19.5(PD3(PCINT19/OC2B/INT1))
D4: U19.6(PD4(PCINT20/XCK/T0))
D5: U19.11(PC5(PCINT21/OC0B/T1))
D6: U19.12(PD6(PCINT22/OC0A/AIN0))
D7: U19.13(PD7(PCINT23/AIN1))
MISO: JP17.1 U20.2(Y0)
MOSI: JP17.4 U20.12(X0)
SCK: JP17.3 U20.5(Z0)
NetU19_17: U19.17(PB3(MOSI/OC2A/PCINT3)) U20.14(X)
NetU19_18: U19.18(PB4(MISO/PCINT4)) U20.15(Y)
NetU19_19: U19.19(PB5(SCK/PCINT5)) U20.4(Z)

### Buses and harness runs
bus B[7..0] = port B[7..0]
bus C[6..0] = port C[6..0]
bus D[7..0] = port D[7..0]

### Notes on the sheet
- REV B: ADDED 4053 AND ISP CONNECTOR

### Library data of the parts
C38 C39 = CAP_Dup1
U21 = REG POS L
U19 = ATmega328: PACKAGE: ATMEGA

## Sheet PAGE121.SchDoc
size 246 x 182 mm
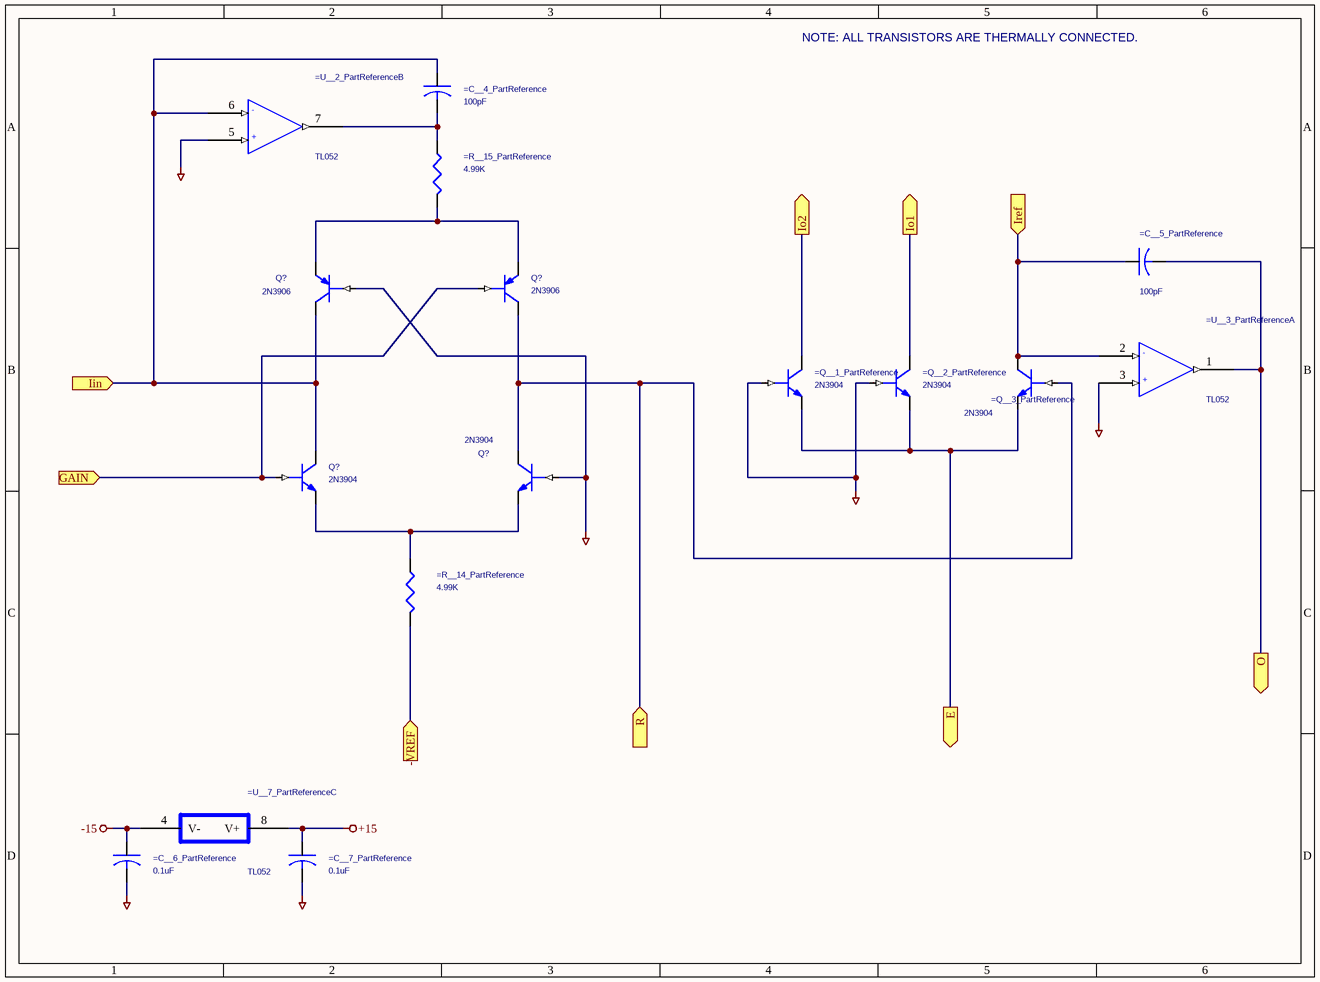
[diagram p23: PAGE121.SchDoc]

### Parts
(Parts that share a designator on the sheet are numbered #1, #2 ... from top to bottom, then left to right.)
=C__4_PartReference  100pF  [RAD0.1]
=C__5_PartReference  100pF  [RAD0.1]
=C__6_PartReference  0.1uF  [AXIALCAP0.3]
=C__7_PartReference  0.1uF  [AXIALCAP0.3]
=Q__1_PartReference  2N3904  [TO92]
=Q__2_PartReference  2N3904  [TO92]
=Q__3_PartReference  2N3904  [TO92]
=R__14_PartReference  4.99K  [AXIAL0.4]
=R__15_PartReference  4.99K  [AXIAL0.4]
=U__2_PartReference  TL052  [DIP8]  (part B of 3)
=U__3_PartReference  TL052  [DIP8]  (part A of 3)
=U__7_PartReference  TL052  [DIP8]  (part C of 3)
Q?#2  2N3906  [TO92]
Q?#3  2N3906  [TO92]
Q?#4  2N3904  [TO92]
Q?#5  2N3904  [TO92]

### Ports
-VREF (in), E (out), GAIN (in), Iin (in), Io1 (out), Io2 (out), Iref (in), O (out), R (in)

### Nets
+15: =C__7_PartReference.1 =U__7_PartReference.8(V+)
-15: =C__6_PartReference.1 =U__7_PartReference.4(V-)
AGND: =C__6_PartReference.2 =C__7_PartReference.2 =Q__1_PartReference.BASE =Q__2_PartReference.BASE =U__2_PartReference.5(+) =U__3_PartReference.3(+) Q?#2.BASE Q?#5.BASE  [project net S2]
Net=C__4_PartReference_1: =C__4_PartReference.1 =U__2_PartReference.6(-) Q?#2.COLLECTOR Q?#4.COLLECTOR ; port Iin
Net=C__4_PartReference_2: =C__4_PartReference.2 =R__15_PartReference.1 =U__2_PartReference.7(OUT)
Net=C__5_PartReference_1: =C__5_PartReference.1 =Q__3_PartReference.COLLECTOR =U__3_PartReference.2(-) ; port Iref
Net=C__5_PartReference_2: =C__5_PartReference.2 =U__3_PartReference.1(OUT) ; port O
Net=Q__1_PartReference_COLLECTOR: =Q__1_PartReference.COLLECTOR ; port Io2
Net=Q__1_PartReference_EMITTER: =Q__1_PartReference.EMITTER =Q__2_PartReference.EMITTER =Q__3_PartReference.EMITTER ; port E
Net=Q__2_PartReference_COLLECTOR: =Q__2_PartReference.COLLECTOR ; port Io1
Net=Q__3_PartReference_BASE: =Q__3_PartReference.BASE Q?#3.COLLECTOR Q?#5.COLLECTOR ; port R
Net=R__14_PartReference_1: =R__14_PartReference.1 Q?#4.EMITTER Q?#5.EMITTER
Net=R__14_PartReference_2: =R__14_PartReference.2 ; port -VREF
Net=R__15_PartReference_2: =R__15_PartReference.2 Q?#2.EMITTER Q?#3.EMITTER
NetQ?#3_BASE: Q?#3.BASE Q?#4.BASE ; port GAIN

### Notes on the sheet
- NOTE: ALL TRANSISTORS ARE THERMALLY CONNECTED.

### Library data of the parts
=C__4_PartReference =C__5_PartReference =C__6_PartReference =C__7_PartReference = CAP_Dup1
=Q__1_PartReference =Q__2_PartReference =Q__3_PartReference Q?#4 Q?#5 = NPN
=R__14_PartReference =R__15_PartReference = R_Dup1
=U__2_PartReference =U__3_PartReference =U__7_PartReference = GEN DUAL OPAMP-H
  =U__2_PartReference: PACKAGE: =U__2_PACKAGE
  =U__3_PartReference: PACKAGE: =U__3_PACKAGE
  =U__7_PartReference: PACKAGE: =U__7_PACKAGE
Q?#2 Q?#3 = PNP

## Nets that join several sheets
+5VR: PAGE113 (JP13.10 JP13.14), POTSCALE1 (=R__3_PartReference_POTSCALE1.1), VCO1 (=JP__PartReference_VCO1.1 =M__PartReference_VCO1.VREF5P =R__9_PartReference_VCO1.1 =R__36_PartReference_VCO1.A), PAGE110 (=U__4_PartReference.6 =U__4_PartReference.7), VCO2 (=JP__PartReference_VCO2.1 =M__PartReference_VCO2.VREF5P =R__9_PartReference_VCO2.1 =R__36_PartReference_VCO2.A), POTSCALE2 (=R__3_PartReference_POTSCALE2.1)
+10VR: PAGE113 (11 pins), PAGE13 (R121.1 R125.1), PAGE110 (6 pins)
+15: PAGE12 (6 pins), PAGE15 (=C__18_PartReference.1 =C__20_PartReference.1 =U__13_PartReference.8 =U__17_PartReference.8), PAGE16 (6 pins), PAGE112 (6 pins), PAGE113 (13 pins), POTSCALE1 (=C__3_PartReference_POTSCALE1.1 U?_POTSCALE1#2.8), PAGE13 (9 pins), PAGE115 (C19.1 R24.1 U?#3.8), VCO1 (=C__12_PartReference_VCO1.1 =U__10_PartReference_VCO1.8), PAGE110 (5 pins), VCO2 (=C__12_PartReference_VCO2.1 =U__10_PartReference_VCO2.8), POTSCALE2 (=C__3_PartReference_POTSCALE2.1 U?_POTSCALE2#2.8), LFO (C107.1 C115.1 U15.8 U49.8), GLIDE (C35.1 C36.1 U16.8 U17.8), PAGE116 (R49.2 R51.1 R52.1), PAGE119 (=C__1_PartReference.1 U?#6.8), PAGE120 (U21.3), PAGE121 (=C__7_PartReference.1 =U__7_PartReference.8)
-5VR: PAGE12 (M16.-VR M17.-VR R241.1), PAGE113 (JP13.9 JP13.13 M15.-VR R240.2), POTSCALE1 (=R__12_PartReference_POTSCALE1.1), VCO1 (=JP__PartReference_VCO1.3 M?_VCO1.-VREF), PAGE110 (=U__5_PartReference.1 =U__5_PartReference.2), VCO2 (=JP__PartReference_VCO2.3 M?_VCO2.-VREF), POTSCALE2 (=R__12_PartReference_POTSCALE2.1), PAGE119 (=R__13_PartReference.A)
-10VR: PAGE113 (8 pins), PAGE110 (5 pins)
-15: PAGE12 (6 pins), PAGE15 (=C__17_PartReference.1 =C__19_PartReference.1 =U__13_PartReference.4 =U__17_PartReference.4), PAGE16 (6 pins), PAGE112 (5 pins), PAGE113 (13 pins), POTSCALE1 (=C__2_PartReference_POTSCALE1.1 U?_POTSCALE1#2.4), PAGE13 (8 pins), PAGE115 (C18.1 U?#3.4), VCO1 (=C__11_PartReference_VCO1.1 =U__10_PartReference_VCO1.4), PAGE110 (5 pins), VCO2 (=C__11_PartReference_VCO2.1 =U__10_PartReference_VCO2.4), POTSCALE2 (=C__2_PartReference_POTSCALE2.1 U?_POTSCALE2#2.4), LFO (C106.1 C114.1 U15.4 U49.4), GLIDE (C33.1 C34.1 U16.4 U17.4), PAGE119 (=C__PartReference.1 U?#6.4), PAGE121 (=C__6_PartReference.1 =U__7_PartReference.4)
REF: PAGE115 (5 pins), PAGE110 (U?#4.3)
S2: PAGE1 (8 pins), PAGE11 (=C__21_PartReference.2 U24#1.7 U24#2.7), PAGE12 (13 pins), PAGE14 (U1.5), PAGE15 (10 pins), PAGE16 (13 pins), PAGE18 (U22.5 U23#1.7 U23#2.7), PAGE111 (U15.5), PAGE112 (6 pins), PAGE113 (69 pins), POTSCALE1 (=C__2_PartReference_POTSCALE1.2 =C__3_PartReference_POTSCALE1.2), PAGE13 (19 pins), PAGE115 (15 pins), VCO1 (7 pins), PAGE110 (10 pins), VCO2 (7 pins), POTSCALE2 (=C__2_PartReference_POTSCALE2.2 =C__3_PartReference_POTSCALE2.2), LFO (10 pins), PAGE114 (C?#3.2 U36.8), GLIDE (10 pins), PAGE116 (10 pins), PAGE118 (=U__9_PartReference.3), PAGE119 (=C__1_PartReference.2 =C__PartReference.2 =D__1_PartReference.CATHODE U?#7.3), PAGE120 (9 pins), PAGE121 (8 pins)
VCC: PAGE11 (7 pins), PAGE18 (9 pins), PAGE113 (9 pins), PAGE13 (R118.1 R122.1 U33.16), PAGE115 (6 pins), PAGE114 (C?#3.1 U36.16), PAGE120 (8 pins)
ADSR1: PAGE113 (M2.IN M4.IN M7.IN M8.IN), PAGE13 (=M26_PartReference.OUT R119.1)
ADSR2: PAGE113 (R7.1), PAGE13 (=M27_PartReference.OUT R123.1)
LFO-F: PAGE113 (M6.IN), PAGE115 (M31.VO2)
Net=M__1_PartReference_VCO1_PWMOUT: PAGE113 (JP4.4), VCO1 (=M__1_PartReference_VCO1.PWMOUT)
Net=M__1_PartReference_VCO1_RAMPOUT: PAGE113 (JP4.2), VCO1 (=M__1_PartReference_VCO1.RAMPOUT)
Net=M__1_PartReference_VCO2_PWMOUT: PAGE113 (JP4.8), VCO2 (=M__1_PartReference_VCO2.PWMOUT)
Net=M__1_PartReference_VCO2_RAMPOUT: PAGE113 (JP4.6), VCO2 (=M__1_PartReference_VCO2.RAMPOUT)
Net=R__5_PartReference_POTSCALE1_2: PAGE113 (JP5.1), POTSCALE1 (=R__5_PartReference_POTSCALE1.2 U?_POTSCALE1#1.7)
Net=R__5_PartReference_POTSCALE2_2: PAGE113 (JP7.1), POTSCALE2 (=R__5_PartReference_POTSCALE2.2 U?_POTSCALE2#1.7)
Net=R__16_PartReference_POTSCALE1_2: PAGE113 (JP5.4), POTSCALE1 (=R__16_PartReference_POTSCALE1.2 =U__PartReference_POTSCALE1.1)
Net=R__16_PartReference_POTSCALE2_2: PAGE113 (JP7.4), POTSCALE2 (=R__16_PartReference_POTSCALE2.2 =U__PartReference_POTSCALE2.1)
Net=R__24_PartReference_VCO1_1: PAGE113 (M10.OUT), VCO1 (=R__24_PartReference_VCO1.1), VCO2 (=R__24_PartReference_VCO2.1)
Net=R__26_PartReference_VCO1_1: PAGE113 (M2.OUT), VCO1 (=R__26_PartReference_VCO1.1), VCO2 (=R__26_PartReference_VCO2.1)
Net=R__27_PartReference_VCO1_1: PAGE113 (M3.OUT), VCO1 (=R__27_PartReference_VCO1.1), VCO2 (=R__27_PartReference_VCO2.1)
Net=R__29_PartReference_VCO1_1: PAGE113 (M4.OUT), VCO1 (=R__29_PartReference_VCO1.1), VCO2 (=R__29_PartReference_VCO2.1)
Net=R__30_PartReference_VCO1_1: PAGE113 (M5.OUT), VCO1 (=R__30_PartReference_VCO1.1), VCO2 (=R__30_PartReference_VCO2.1)
NetJP9_4: PAGE113 (JP9.4), PAGE13 (U29.7)
NetJP9_8: PAGE113 (JP9.8), PAGE13 (U30.7)
NetJP9_12: PAGE113 (JP9.12), PAGE13 (U31.15)
NetJP9_16: PAGE113 (JP9.16), PAGE13 (U30.10)
NetJP10_4: PAGE113 (JP10.4), PAGE13 (U31.10)
NetJP10_8: PAGE113 (JP10.8), PAGE13 (U29.15)
NetJP10_12: PAGE113 (JP10.12), PAGE13 (U30.2)
NetJP10_16: PAGE113 (JP10.16), PAGE13 (U31.7)
NetM1#1_IN: PAGE113 (M1#1.IN), PAGE115 (M31.VO1)
NetM10_IN: PAGE113 (M10.IN), PAGE115 (M31.VO0)
NetR9_1: PAGE113 (R9.1), PAGE13 (U29.8 U30.16 U33.4)
NetR11_1: PAGE113 (R11.1), PAGE13 (U30.8 U31.16 U33.5)
NetR14_1: PAGE113 (R14.1), PAGE13 (U29.1 U30.9 U33.6)
NetR16_1: PAGE113 (R16.1), PAGE13 (U29.9 U31.9 U33.12)
NetR17_1: PAGE113 (R17.1), PAGE13 (U29.16 U30.1 U33.11)
NetR18_1: PAGE113 (R18.1), PAGE13 (U31.1 U31.8 U33.10)
PW1: PAGE113 (JP13.12), VCO1 (R?_VCO1.1)
PW2: PAGE113 (JP13.16), VCO2 (R?_VCO2.1)
VP1: PAGE113 (JP5.2), VCO1 (=R__25_PartReference_VCO1.1)
VP2: PAGE113 (JP7.2), VCO2 (=R__25_PartReference_VCO2.1)